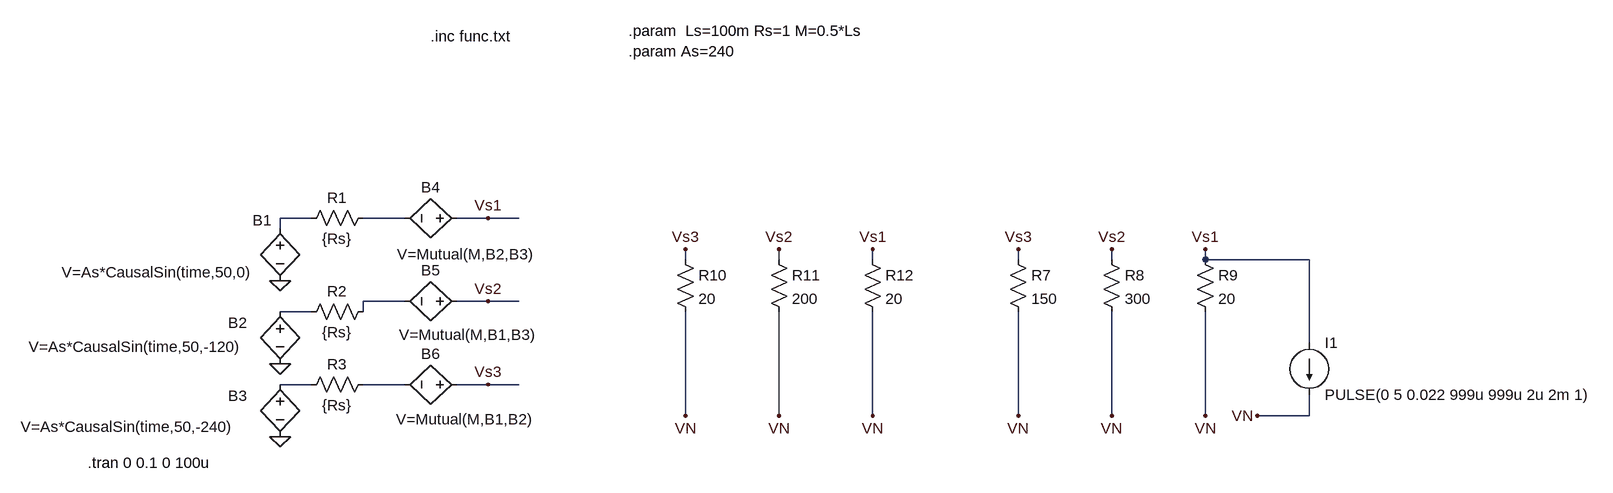
[diagram p0: schematic TransfoTri-Sec.asc]
TransfoTri-Sec.asc, the LTspice schematic file:
Version 4
SHEET 1 1560 924
WIRE -480 0 -528 0
WIRE -336 0 -400 0
WIRE -208 0 -256 0
WIRE -160 0 -208 0
WIRE -528 16 -528 0
WIRE 96 64 96 48
WIRE 240 64 240 48
WIRE 384 64 384 48
WIRE 608 64 608 48
WIRE 752 64 752 48
WIRE 896 64 896 48
WIRE 1056 64 896 64
WIRE -336 128 -400 128
WIRE -208 128 -256 128
WIRE -160 128 -208 128
WIRE -480 144 -528 144
WIRE -400 144 -400 128
WIRE 1056 192 1056 64
WIRE -480 256 -528 256
WIRE -336 256 -400 256
WIRE -208 256 -256 256
WIRE -160 256 -208 256
WIRE 96 304 96 144
WIRE 240 304 240 144
WIRE 384 304 384 144
WIRE 608 304 608 144
WIRE 752 304 752 144
WIRE 896 304 896 144
WIRE 1056 304 1056 272
WIRE 1056 304 976 304
FLAG -528 96 0
FLAG -528 224 0
FLAG -528 336 0
FLAG 384 48 Vs1
FLAG 240 48 Vs2
FLAG 96 48 Vs3
FLAG 896 48 Vs1
FLAG 752 48 Vs2
FLAG 608 48 Vs3
FLAG -208 256 Vs3
FLAG -208 128 Vs2
FLAG -208 0 Vs1
FLAG 96 304 VN
FLAG 240 304 VN
FLAG 384 304 VN
FLAG 608 304 VN
FLAG 752 304 VN
FLAG 896 304 VN
FLAG 976 304 VN
SYMBOL bv -528 0 R0
WINDOW 0 -42 3 Left 2
WINDOW 3 -336 83 Left 2
SYMATTR InstName B1
SYMATTR Value V=As*CausalSin(time,50,0)
SYMBOL bv -528 128 R0
WINDOW 0 -80 33 Left 2
WINDOW 3 -387 70 Left 2
SYMATTR InstName B2
SYMATTR Value V=As*CausalSin(time,50,-120)
SYMBOL bv -528 240 R0
WINDOW 0 -80 33 Left 2
WINDOW 3 -399 81 Left 2
SYMATTR InstName B3
SYMATTR Value V=As*CausalSin(time,50,-240)
SYMBOL res -384 -16 R90
WINDOW 0 0 56 VBottom 2
WINDOW 3 32 56 VTop 2
SYMATTR InstName R1
SYMATTR Value {Rs}
SYMBOL res -384 128 R90
WINDOW 0 0 56 VBottom 2
WINDOW 3 32 56 VTop 2
SYMATTR InstName R2
SYMATTR Value {Rs}
SYMBOL res -384 240 R90
WINDOW 0 0 56 VBottom 2
WINDOW 3 32 56 VTop 2
SYMATTR InstName R3
SYMATTR Value {Rs}
SYMBOL bv -240 256 M270
WINDOW 3 -38 4 VBottom 2
WINDOW 0 32 56 VTop 2
SYMATTR Value V=Mutual(M,B1,B2)
SYMATTR InstName B6
SYMBOL bv -240 0 M270
WINDOW 3 -40 2 VBottom 2
WINDOW 0 32 56 VTop 2
SYMATTR Value V=Mutual(M,B2,B3)
SYMATTR InstName B4
SYMBOL bv -240 128 M270
WINDOW 3 -36 -1 VBottom 2
WINDOW 0 32 56 VTop 2
SYMATTR Value V=Mutual(M,B1,B3)
SYMATTR InstName B5
SYMBOL res 80 48 R0
SYMATTR InstName R10
SYMATTR Value 20
SYMBOL res 224 48 R0
SYMATTR InstName R11
SYMATTR Value 200
SYMBOL res 368 48 R0
SYMATTR InstName R12
SYMATTR Value 20
SYMBOL res 592 48 R0
SYMATTR InstName R7
SYMATTR Value 150
SYMBOL res 736 48 R0
SYMATTR InstName R8
SYMATTR Value 300
SYMBOL res 880 48 R0
SYMATTR InstName R9
SYMATTR Value 20
SYMBOL current 1056 192 R0
WINDOW 123 0 0 Left 2
WINDOW 39 24 108 Left 2
SYMATTR InstName I1
SYMATTR Value PULSE(0 5 0.022 999u 999u 2u 2m 1)
TEXT -824 376 Left 2 !.tran 0 0.1 0 100u
TEXT 8 -288 Left 2 !.param  Ls=100m Rs=1 M=0.5*Ls\n.param As=240
TEXT -296 -280 Left 2 !.inc func.txt

The netlist it stands for:
* TransfoTri-Sec.asc
B1 N001 0 V=As*CausalSin(time,50,0)
B2 N004 0 V=As*CausalSin(time,50,-120)
B3 N005 0 V=As*CausalSin(time,50,-240)
R1 N002 N001 {Rs}
R2 N003 N004 {Rs}
R3 N006 N005 {Rs}
B6 Vs3 N006 V=Mutual(M,B1,B2)
B4 Vs1 N002 V=Mutual(M,B2,B3)
B5 Vs2 N003 V=Mutual(M,B1,B3)
R10 Vs3 VN 20
R11 Vs2 VN 200
R12 Vs1 VN 20
R7 Vs3 VN 150
R8 Vs2 VN 300
R9 Vs1 VN 20
I1 Vs1 VN PULSE(0 5 0.022 999u 999u 2u 2m 1)
.tran 0 0.1 0 100u
.param  Ls=100m Rs=1 M=0.5*Ls
.param As=240
.inc func.txt
.backanno
.end